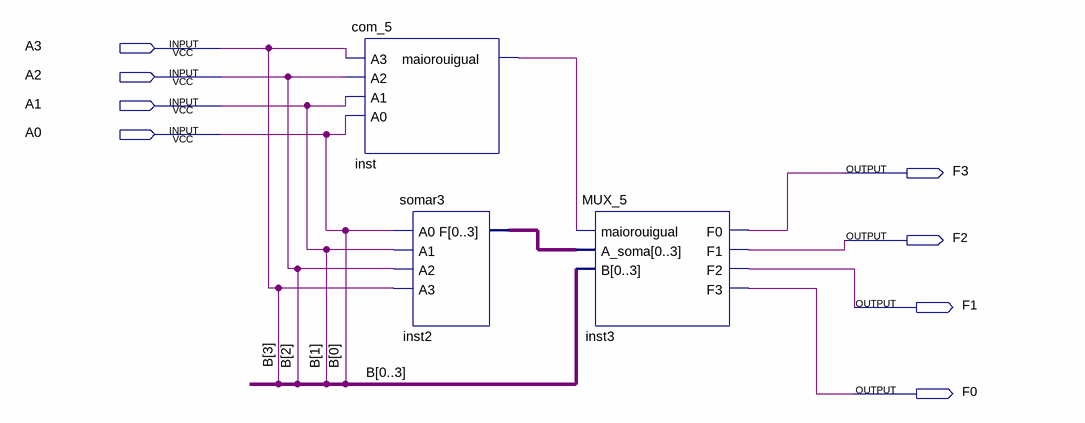
[diagram p0: schematic sheet]
// Quartus schematic dd.bdf as structural Verilog: 3 symbols, 8 pins
module dd (
  input  A3,
  input  A2,
  input  A1,
  input  A0,
  output F3,
  output F2,
  output F1,
  output F0
);

  wire inst_maiorouigual;
  wire [3:0] inst2_f;

  com_5 inst (.A3(A3), .A2(A2), .A1(A1), .A0(A0), .maiorouigual(inst_maiorouigual));
  somar3 inst2 (.A0(A0), .A1(A1), .A2(A2), .A3(A3), .F(inst2_f));
  MUX_5 inst3 (
    .maiorouigual(inst_maiorouigual), .A_soma(inst2_f), .B({A0, A1, A2, A3}), .F0(F3), .F1(F2), .F2(F1),
    .F3(F0));

  // Other names for the same wires on the sheet: B[3:0] = {A3, A2, A1, A0}
endmodule
